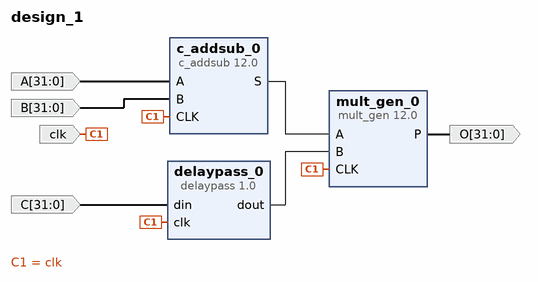
[diagram p0: block diagram of the top level]
# Vivado block design design_1, xc7a12ticsg325-1L, Vivado 2019.1
create_bd_design design_1

create_bd_port -dir I -from 31 -to 0 A
create_bd_port -dir I -from 31 -to 0 B
create_bd_port -dir I -from 31 -to 0 C
create_bd_port -dir I -type clk clk
set_property -dict {CONFIG.FREQ_HZ 100000000} [get_bd_ports clk]
create_bd_port -dir O -from 31 -to 0 O

create_bd_cell -type ip -vlnv xilinx.com:ip:c_addsub:12.0 c_addsub_0
set_property -dict [list \
  CONFIG.A_Width 32 \
  CONFIG.B_Value 00000000000000000000000000000000 \
  CONFIG.B_Width 32 \
  CONFIG.Latency 1 \
  CONFIG.Out_Width 32 \
] [get_bd_cells c_addsub_0]
create_bd_cell -type ip -vlnv xilinx.com:ip:mult_gen:12.0 mult_gen_0
set_property -dict [list \
  CONFIG.OutputWidthHigh 31 \
  CONFIG.PortAWidth 32 \
  CONFIG.PortBWidth 32 \
  CONFIG.Use_Custom_Output_Width true \
] [get_bd_cells mult_gen_0]
create_bd_cell -type ip -vlnv user.org:user:delaypass:1.0 delaypass_0
set_property -dict {CONFIG.W 32} [get_bd_cells delaypass_0]

# ---- connections ----

connect_bd_net [get_bd_pins c_addsub_0/S] [get_bd_pins mult_gen_0/A]
connect_bd_net [get_bd_pins delaypass_0/dout] [get_bd_pins mult_gen_0/B]
connect_bd_net [get_bd_ports clk] [get_bd_pins c_addsub_0/CLK] [get_bd_pins mult_gen_0/CLK] [get_bd_pins delaypass_0/clk]
connect_bd_net [get_bd_pins mult_gen_0/P] [get_bd_ports O]
connect_bd_net [get_bd_ports A] [get_bd_pins c_addsub_0/A]
connect_bd_net [get_bd_ports B] [get_bd_pins c_addsub_0/B]
connect_bd_net [get_bd_ports C] [get_bd_pins delaypass_0/din]

validate_bd_design
save_bd_design
